# Altium schematic sheet channel56.SchDoc
size A4
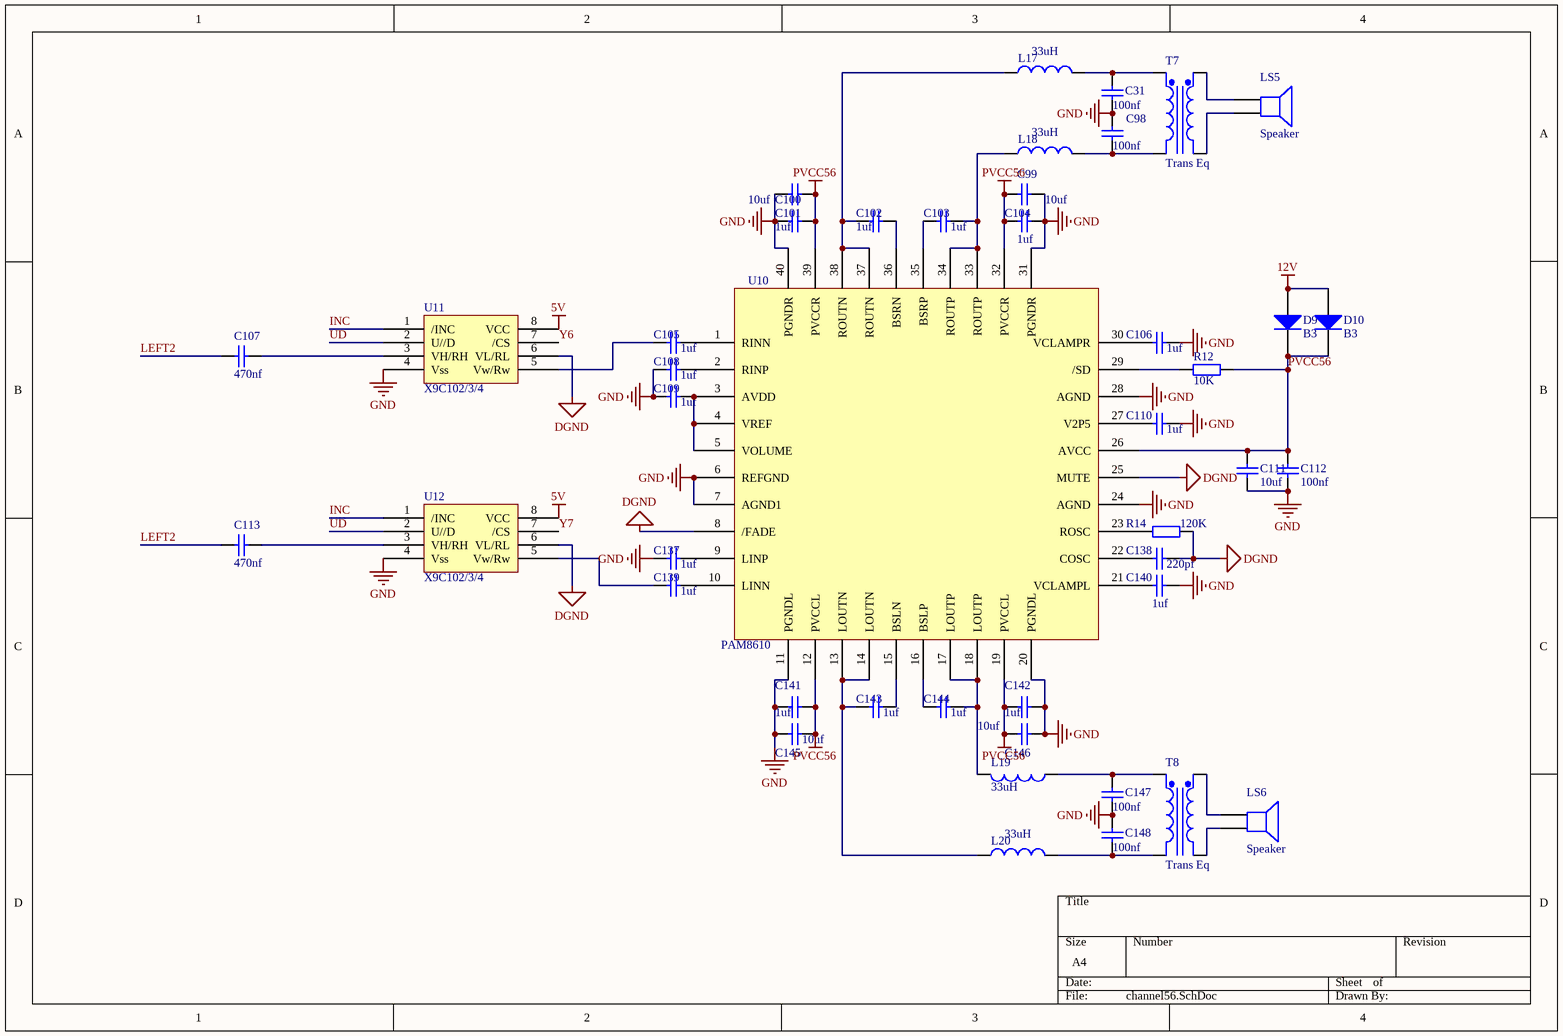
[diagram p0: channel56.SchDoc]

## Parts
C31  100nf  [0805C]
C98  100nf  [0805C]
C99  10uf  [0805C]
C100  10uf  [0805C]
C101  1uf  [0805C]
C102  1uf  [0805C]
C103  1uf  [0805C]
C104  1uf  [0805C]
C105  1uf  [0805C]
C106  1uf  [0805C]
C107  470nf  [0805C]
C108  1uf  [0805C]
C109  1uf  [0805C]
C110  1uf  [0805C]
C111  10uf  [0805C]
C112  100nf  [0805C]
C113  470nf  [0805C]
C137  1uf  [0805C]
C138  220pf  [0805C]
C139  1uf  [0805C]
C140  1uf  [0805C]
C141  1uf  [0805C]
C142  1uf  [0805C]
C143  1uf  [0805C]
C144  1uf  [0805C]
C145  10uf  [0805C]
C146  10uf  [0805C]
C147  100nf  [0805C]
C148  100nf  [0805C]
D9  B3  [LL-34 - duplicate]
D10  B3  [LL-34 - duplicate]
L17  33uH  [L0805]
L18  33uH  [L0805]
L19  33uH  [L0805]
L20  33uH  [L0805]
LS5  Speaker  [耳机座]
LS6  Speaker  [耳机座]
R12  10K  [0805R]
R14  120K  [0805R]
T7  Trans Eq  [Transistor]
T8  Trans Eq  [Transistor]
U10  PAM8610  [QFN40-0.5]
U11  X9C102/3/4  [sop_8]
U12  X9C102/3/4  [sop_8]

## Nets
5V: U11.8(VCC) U12.8(VCC)
12V: D9.1(A) D10.1(A)
DGND: C138.1 R14.2 U10.8(/FADE) U10.25(MUTE) U11.6(VL/RL) U12.6(VL/RL)
GND: C31.2 C98.1 C99.2 C100.1 C101.1 C104.2 C106.1 C108.2 C109.2 C110.1 C111.2 C112.2 C137.2 C140.2 C141.2 C142.1 C145.2 C146.1 C147.2 C148.1 U10.6(REFGND) U10.7(AGND1) U10.11(PGNDL) U10.20(PGNDL) U10.24(AGND) U10.28(AGND) U10.31(PGNDR) U10.40(PGNDR) U11.4(Vss) U12.4(Vss)
PVCC56: C99.1 C100.2 C101.2 C104.1 C111.1 C112.1 C141.1 C142.2 C145.1 C146.2 D9.2(K) D10.2(K) R12.1 U10.12(PVCCL) U10.19(PVCCL) U10.26(AVCC) U10.32(PVCCR) U10.39(PVCCR)
INC: U11.1(/INC) U12.1(/INC)
LEFT2: C107.2 C113.2
UD: U11.2(U//D) U12.2(U//D)
Y6: U11.7(/CS)
Y7: U12.7(/CS)
NetC31_1: C31.1 L17.2 T7.1(Pri+)
NetC98_2: C98.2 L18.2 T7.2(Pri-)
NetC102_1: C102.1 U10.36(BSRN)
NetC102_2: C102.2 L17.1 U10.37(ROUTN) U10.38(ROUTN)
NetC103_1: C103.1 L18.1 U10.33(ROUTP) U10.34(ROUTP)
NetC103_2: C103.2 U10.35(BSRP)
NetC105_1: C105.1 U10.1(RINN)
NetC105_2: C105.2 U11.5(Vw/Rw)
NetC106_2: C106.2 U10.30(VCLAMPR)
NetC107_1: C107.1 U11.3(VH/RH)
NetC108_1: C108.1 U10.2(RINP)
NetC109_1: C109.1 U10.3(AVDD) U10.4(VREF) U10.5(VOLUME)
NetC110_2: C110.2 U10.27(V2P5)
NetC113_1: C113.1 U12.3(VH/RH)
NetC137_1: C137.1 U10.9(LINP)
NetC138_2: C138.2 U10.22(COSC)
NetC139_1: C139.1 U10.10(LINN)
NetC139_2: C139.2 U12.5(Vw/Rw)
NetC140_1: C140.1 U10.21(VCLAMPL)
NetC143_1: C143.1 U10.15(BSLN)
NetC143_2: C143.2 L20.1 U10.13(LOUTN) U10.14(LOUTN)
NetC144_1: C144.1 L19.2 U10.17(LOUTP) U10.18(LOUTP)
NetC144_2: C144.2 U10.16(BSLP)
NetC147_1: C147.1 L19.1 T8.1(Pri+)
NetC148_2: C148.2 L20.2 T8.2(Pri-)
NetLS5_1: LS5.1 T7.3(Sec+)
NetLS5_2: LS5.2 T7.4(Sec-)
NetLS6_1: LS6.1 T8.3(Sec+)
NetLS6_2: LS6.2 T8.4(Sec-)
NetR12_2: R12.2 U10.29(/SD)
NetR14_1: R14.1 U10.23(ROSC)

## Library data of the parts
C31 C98-C113 C137-C148 = Cap: Capacitor; Value: 0.1uF; Published: 8-Jun-2000; LatestRevisionDate: 17-Jul-2002; LatestRevisionNote: Re-released for DXP Platform.; PackageReference: RAD-0.3; Publisher: Altium Limited; PackageDescription: Radial Cap, Thru-Hole; 2 Leads; 0.3 in Pin Spacing
D9 D10 = Diode 1N4148: High Conductance Fast Diode; Published: 8-Jun-2000; LatestRevisionDate: 17-Jul-2002; LatestRevisionNote: Re-released for DXP Platform.; DatasheetVersion: 1997; PackageReference: DO-35; Publisher: Altium Limited; PackageDescription: Diode, Axial; Body 3.8 x 1.9 mm (LxDia. max), Lead Dia. 0.53 mm (max); Code_JEDEC: DO-204-AH; ComponentLink1Description: Manufacturer Link; ComponentLink1URL: http://www.fairchildsemi.com/; ComponentLink2Description: Datasheet; ComponentLink2URL: http://www.fairchildsemi.com/ds/1N%2F1N4148.pdf
L17-L20 = Inductor: Code_IEC: 1005; Published: 8-Jun-2000; LatestRevisionDate: 29-May-2009; LatestRevisionNote: IPC-7351 Footprint Added.; PackageReference: 0402-A; Publisher: Altium Limited; PackageDescription: Chip Inductor; Code_JEITA: 0402
LS5 LS6 = Speaker: Loudspeaker; Published: 24-Mar-1999; LatestRevisionDate: 17-Jul-2002; LatestRevisionNote: Re-released for DXP Platform.; PackageReference: PIN2; Publisher: Altium Limited
R12 = Res2: Resistor; Published: 8-Jun-2000; LatestRevisionDate: 17-Jul-2002; LatestRevisionNote: Re-released for DXP Platform.; PackageReference: AXIAL-0.4; Publisher: Altium Limited; PackageDescription: Axial Device, Thru-Hole; 2 Leads; 0.4 in Pin Spacing; Value: 10K
R14 = Res2: Resistor; Value: 10K; Published: 8-Jun-2000; LatestRevisionDate: 17-Jul-2002; LatestRevisionNote: Re-released for DXP Platform.; PackageReference: AXIAL-0.4; Publisher: Altium Limited; PackageDescription: Axial Device, Thru-Hole; 2 Leads; 0.4 in Pin Spacing
T7 T8 = Trans Eq: Transformer (Equivalent Circuit Model); Published: 8-Jun-2000; LatestRevisionDate: 17-Jul-2002; LatestRevisionNote: Re-released for DXP Platform.; PackageReference: TRF_4; Publisher: Altium Limited; PackageDescription: Transformer; 4 Leads